# Altium project 迷你随车充液晶显示板.PrjPCB
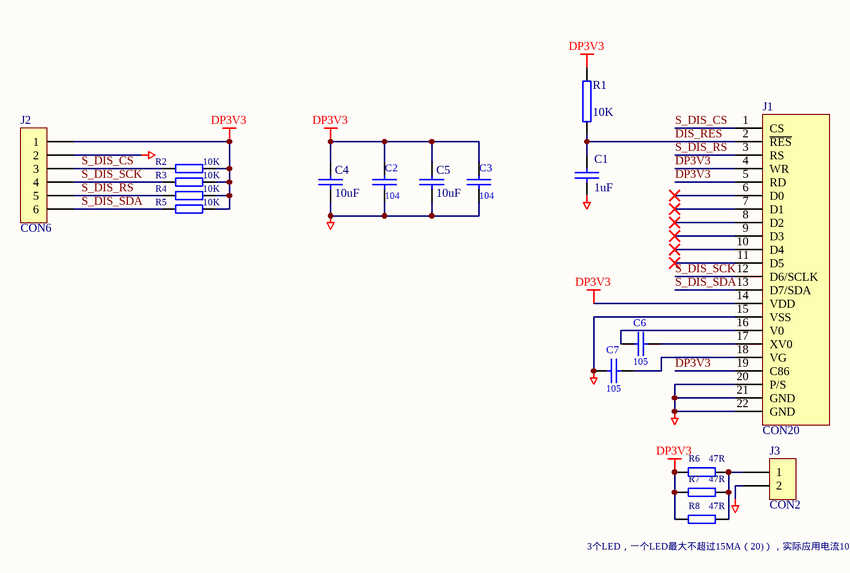
[diagram p0: 迷你随车充液晶显示板.SchDoc]
1 sheet, 18 parts. Net scope: global (net labels, ports and power ports of the same name join across sheets).
Board file: 迷你随车充液晶显示板.PcbDoc

## Sheet 迷你随车充液晶显示板.SchDoc
size A4; SheetNumber: 0; SheetTotal: 0

### Parts
C1  1uF  [0603C]
C2  104  [0603C]
C3  104  [0603C]
C4  10uF  [0805C]
C5  10uF  [0805C]
C6  105  [0603C]
C7  105  [0603C]
J1  CON20  [FPC20-0.5mm]
J2  CON6  [CON06_2.54]
J3  CON2  [JXL12864G-1504]
R1  10K  [0603R]
R2  10K  [0603R]
R3  10K  [0603R]
R4  10K  [0603R]
R5  10K  [0603R]
R6  47R  [0603R]
R7  47R  [0603R]
R8  47R  [0603R]

### Nets
DGND: C1.1 C2.1 C3.1 C4.2 C5.2 C7.2 J1.15(VSS) J1.20(P/S) J1.21(GND) J1.22(GND) J2.2 J3.2
DP3V3: C2.2 C3.2 C4.1 C5.1 J1.4(WR) J1.5(RD) J1.14(VDD) J1.19(C86) J2.1 R1.1 R2.2 R3.2 R4.2 R5.2 R6.1 R7.1 R8.1
DIS_RES: C1.2 J1.2(~{RES}) R1.2
S_DIS_CS: J1.1(CS) J2.3 R2.1
S_DIS_RS: J1.3(RS) J2.5 R4.1
S_DIS_SCK: J1.12(D6/SCLK) J2.4 R3.1
S_DIS_SDA: J1.13(D7/SDA) J2.6 R5.1
NetC6_1: C6.1 J1.17(XV0)
NetC6_2: C6.2 J1.16(V0)
NetC7_1: C7.1 J1.18(VG)
NetJ3_1: J3.1 R6.2 R7.2 R8.2

Not connected (* = marked no-connect by the designer): J1 6(D0)* 7(D1)* 8(D2)* 9(D3)* 10(D4)* 11(D5)*

### Notes on the sheet
- (near R8) 3个LED，一个LED最大不超过15MA（20)），实际应用电流10MA

### Library data of the parts
C1 = CAP1: 0603贴片电容/50V/0.1uF/±10%/X7R
C2 C3 C6 C7 = CAP: Capacitor
C4 C5 = CAP1
J1 = CON20: Connector
J2 = CON6: Connector
J3 = CON2: Connector
R1 = RES1: 0603贴片电阻/10K/0.1W/±5%
R2-R8 = RES-1: RES